# Altium schematic sheet AUDIO.SchDoc
size A3; SheetNumber: 6; SheetTotal: 6
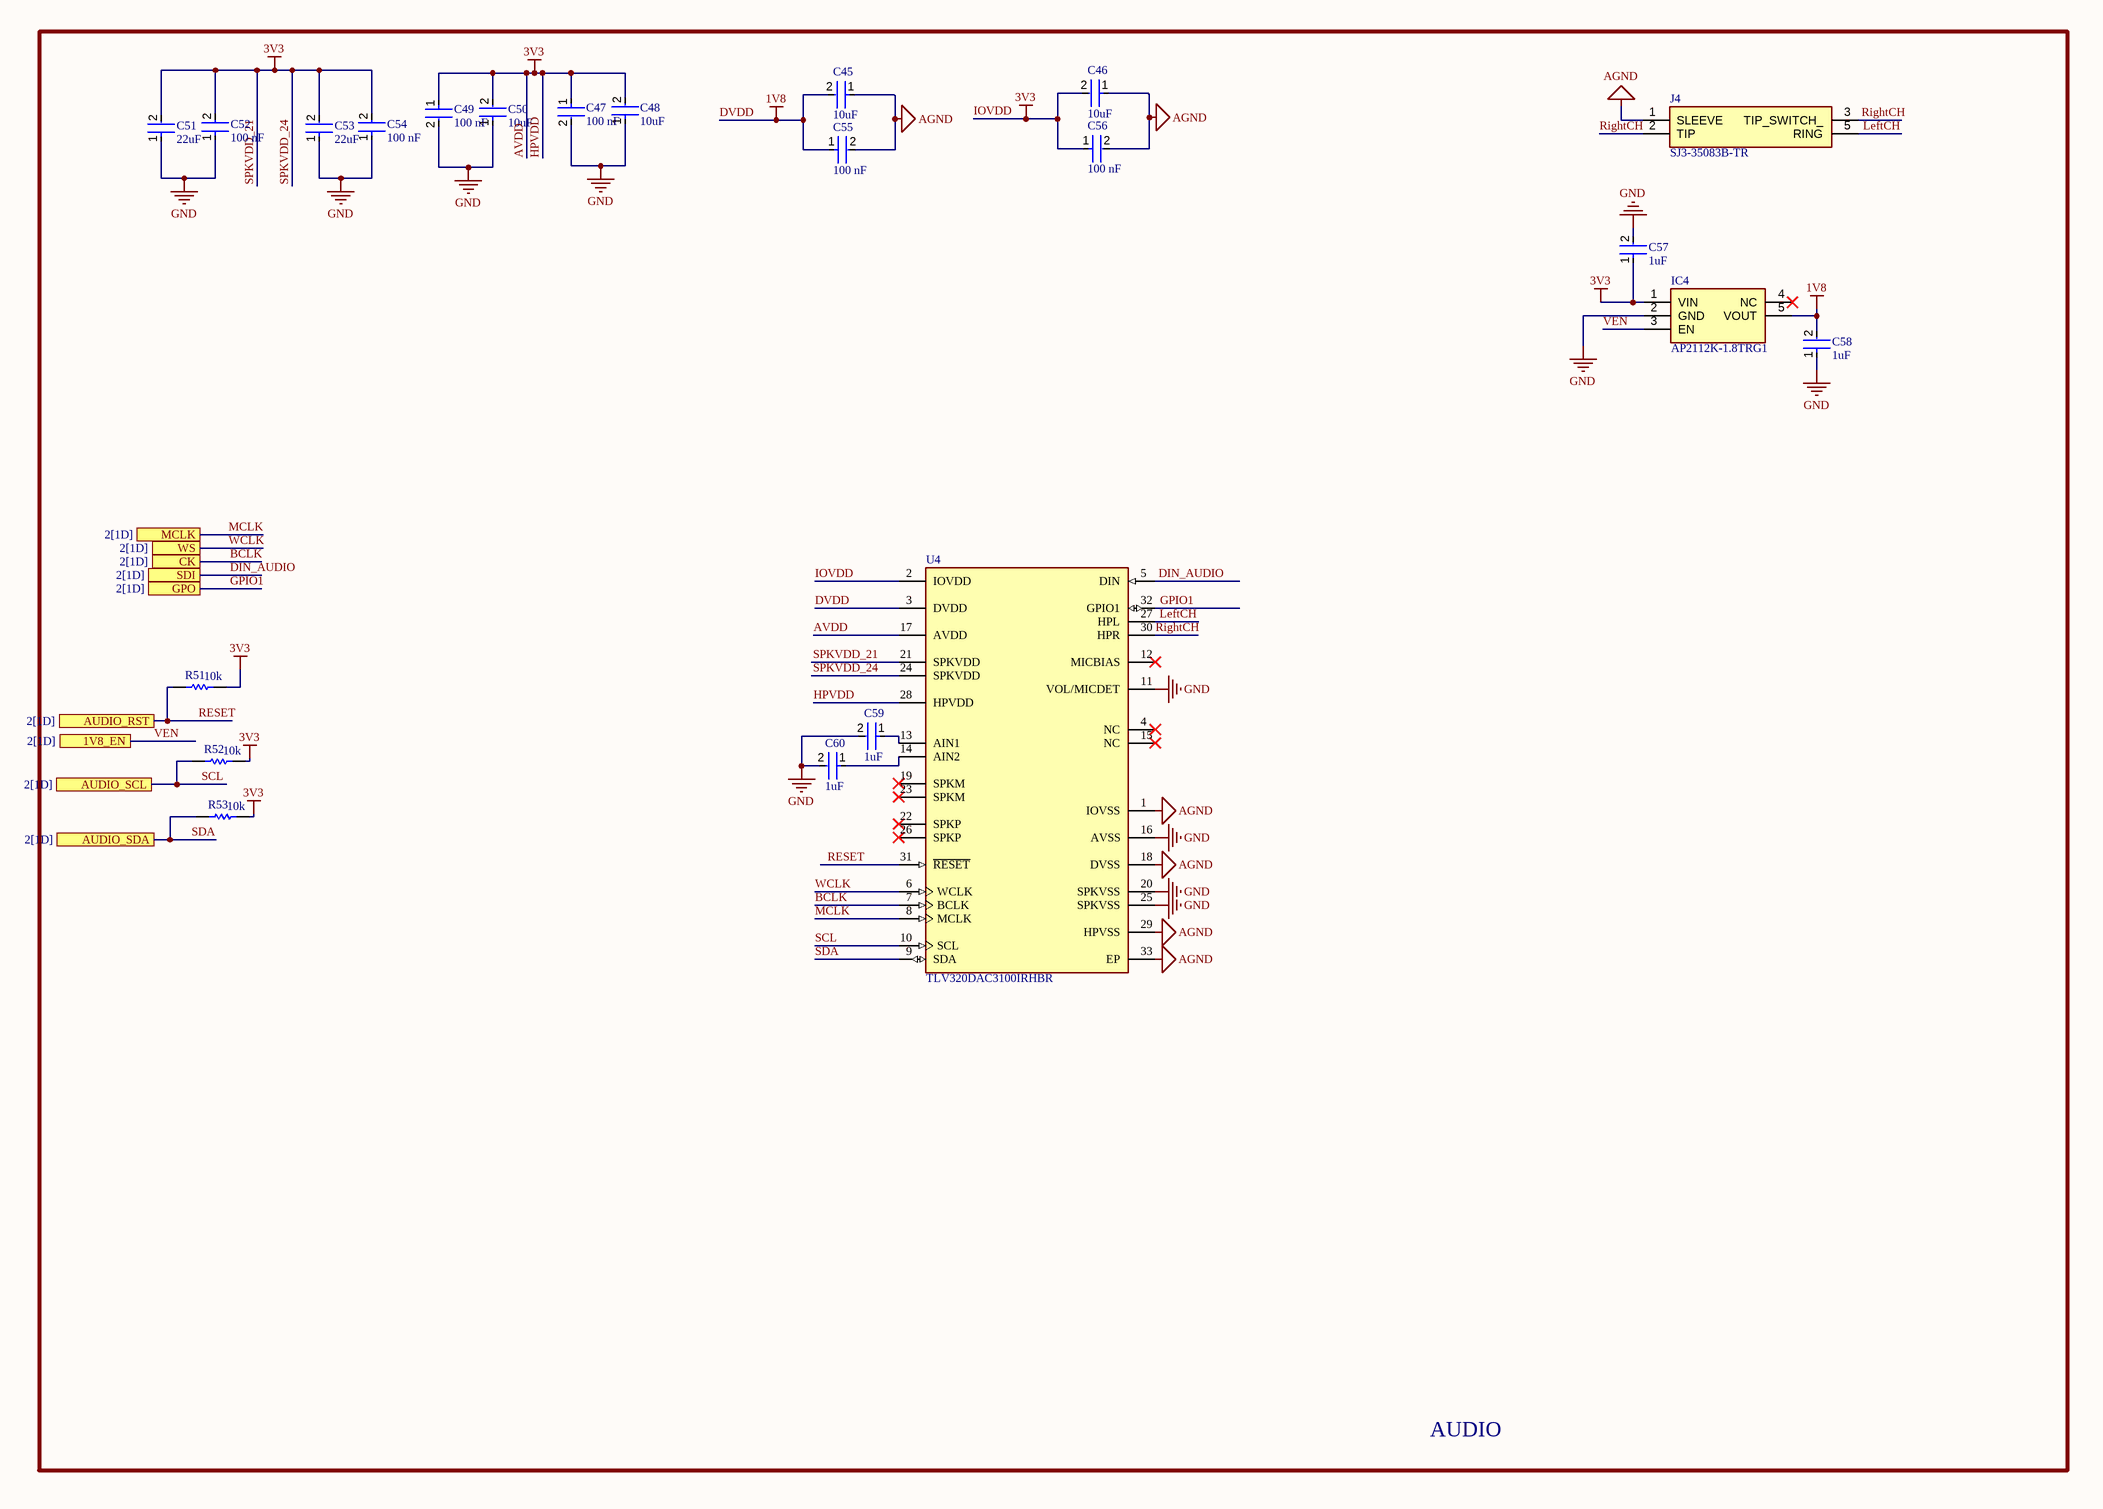
[diagram p0: AUDIO.SchDoc]

## Parts
C45  Capacitance: 10uF  [FP-GRM21B-0_15-IPC_A]  (hidden comment: GRM21BR61E106MA73L)
C46  Capacitance: 10uF  [FP-GRM21B-0_15-IPC_A]  (hidden comment: GRM21BR61E106MA73L)
C47  value 100 nF  [FP-CC0603-DA-MFG]  (hidden comment: CC0603KRX7R7BB104)
C48  Capacitance: 10uF  [FP-GRM21B-0_15-IPC_A]  (hidden comment: GRM21BR61E106MA73L)
C49  value 100 nF  [FP-CC0603-DA-MFG]  (hidden comment: CC0603KRX7R7BB104)
C50  Capacitance: 10uF  [FP-GRM21B-0_15-IPC_A]  (hidden comment: GRM21BR61E106MA73L)
C51  Capacitance: 22uF  [FP-1210-L_3_2_0_3-W_2_5_0-IPC_A]  (hidden comment: EMK325B7226MM-PR)
C52  value 100 nF  [FP-CC0603-DA-MFG]  (hidden comment: CC0603KRX7R7BB104)
C53  Capacitance: 22uF  [FP-1210-L_3_2_0_3-W_2_5_0-IPC_A]  (hidden comment: EMK325B7226MM-PR)
C54  value 100 nF  [FP-CC0603-DA-MFG]  (hidden comment: CC0603KRX7R7BB104)
C55  value 100 nF  [FP-CC0603-DA-MFG]  (hidden comment: CC0603KRX7R7BB104)
C56  value 100 nF  [FP-CC0603-DA-MFG]  (hidden comment: CC0603KRX7R7BB104)
C57  Capacitance: 1uF  [FP-CL21-IPC_B]  (hidden comment: CL21F105ZAFNNNF)
C58  Capacitance: 1uF  [FP-CL21-IPC_B]  (hidden comment: CL21F105ZAFNNNF)
C59  Capacitance: 1uF  [FP-CL21-IPC_B]  (hidden comment: CL21F105ZAFNNNF)
C60  Capacitance: 1uF  [FP-CL21-IPC_B]  (hidden comment: CL21F105ZAFNNNF)
IC4  AP2112K-1.8TRG1  [SOT95P285X140-5N]
J4  SJ3-35083B-TR  [SJ335083BTR]
R51  value 10k  [RESC1609X55X30NL10T20]  (hidden comment: TNPW060310K0BEEN)
R52  value 10k  [RESC1609X55X30NL10T20]  (hidden comment: TNPW060310K0BEEN)
R53  value 10k  [RESC1609X55X30NL10T20]  (hidden comment: TNPW060310K0BEEN)
U4  TLV320DAC3100IRHBR  [FP-RHB0032E-IPC_C]

## Ports
1V8_EN (see 2[1D]), AUDIO_RST (see 2[1D]), AUDIO_SCL (see 2[1D]), AUDIO_SDA (see 2[1D]), CK (see 2[1D]), GPO (see 2[1D]), MCLK (see 2[1D]), SDI (see 2[1D]), WS (see 2[1D])

## Nets
AGND: C45.1 C46.1 C55.2 C56.2 J4.1(SLEEVE) U4.1(IOVSS) U4.18(DVSS) U4.29(HPVSS) U4.33(EP)
AVDD: C46.2 C47.1 C48.2 C49.1 C50.2 C51.2 C52.2 C53.2 C54.2 C56.1 C57.1 IC4.1(VIN) R51.1 R52.1 R53.1 U4.2(IOVDD) U4.17(AVDD) U4.21(SPKVDD) U4.24(SPKVDD) U4.28(HPVDD)  [also labelled 3V3, HPVDD, IOVDD, SPKVDD_21, SPKVDD_24]
DVDD: C45.2 C55.1 C58.2 IC4.5(VOUT) U4.3(DVDD)  [also labelled 1V8]
GND: C47.2 C48.1 C49.2 C50.1 C51.1 C52.1 C53.1 C54.1 C57.2 C58.1 C59.2 C60.2 IC4.2(GND) U4.11(VOL/MICDET) U4.16(AVSS) U4.20(SPKVSS) U4.25(SPKVSS)
BCLK: U4.7(BCLK) ; port CK
DIN_AUDIO: U4.5(DIN) ; port SDI
GPIO1: U4.32(GPIO1) ; port GPO
LeftCH: J4.5(RING) U4.27(HPL)
MCLK: U4.8(MCLK) ; port MCLK
RESET: R51.2 U4.31(~{RESET}) ; port AUDIO_RST
RightCH: J4.2(TIP) J4.3(TIP_SWITCH_) U4.30(HPR)
SCL: R52.2 U4.10(SCL) ; port AUDIO_SCL
SDA: R53.2 U4.9(SDA) ; port AUDIO_SDA
VEN: IC4.3(EN) ; port 1V8_EN
WCLK: U4.6(WCLK) ; port WS
NetC59_1: C59.1 U4.13(AIN1)
NetC60_1: C60.1 U4.14(AIN2)

Not connected (* = marked no-connect by the designer): IC4 4(NC)*; U4 4(NC)* 12(MICBIAS)* 15(NC)* 19(SPKM)* 22(SPKP)* 23(SPKM)* 26(SPKP)*

## Notes on the sheet
- AUDIO
- THIS DOCUMENT AND THE DATA DISCLOSED HEREIN OR
- HEREWITH IS THE PROPERTY OF ALTIUM LIMITED AND MAY
- DWG NO:
- REVISION
- REV:
- DESCRIPTION
- DATE
- APPROVED
- BE FREELY DISTRIBUTED IN WHOLE. NO RIGHTS ARE
- RESERVED OR EXPRESS OR IMPLIED WARANTEE GIVEN.
- ENG:
- APPROVALS
- PROJECT
- DSN:
- CHK:
- REFERENCE DOCUMENTS
- PROJECT REVISION:
- TITLE
- DOCUMENT REVISION:
- DESIGN ITEM:
- BOM:
- FAB DWG:
- PCB DWG:
- ASSY DWG:
- SCALE:
- A3
- SIZE
- CAGE CODE
- FILE NAME
- DWG NO.
- SHEET
- OF
- REV

## Library data of the parts
C45 C46 C48 C50 = CMP-06035-013048-1: Chip Multilayer Ceramic Capacitors for General Purpose, 0805, 10uF, X5R, 15%, 20%, 25V; Max Operating Temperature: 85°C; Package Quantity: 3000; Case/Package: 0805; Depth: 1.25mm; Case Code (Imperial): 0805; Termination: SMD/SMT; Width: 0.049inch; Packaging: Tape and Reel; Tolerance: 20%; Height: 1.25mm; Min Operating Temperature: -55°C; Weight: 0.000335oz; Voltage Rating (DC): 25V; Dielectric: X5R; Length: 2mm; Thickness: 0.055inch; Voltage Rating: 25V; Resistor Type: Ceramic; Lead Free: Lead Free; Case Code (Metric): 2012; Mount: Surface Mount; REACH SVHC: No SVHC
C47 C49 C52 C54-C56 = CMP-2000-05002-2: CAP CER 0.1UF 16V X7R 0603; Manufacturer: YAGEO; Tolerance: 0.1; Temperature Coefficient: 15%; Material: Ceramic; Voltage Rating: 16 V; Package: CC0603-DA; ComponentLink2Description: Datasheet; Octopart: https://octopart.com/cc0603krx7r7bb104-yageo-192941; Temperature Range High: +125°C; Digikey Description: CAP CER 0.1UF 16V X7R 0603; Voltage: 16 V; Device Class L2: Capacitors; Height: 0.9mm; Temperature: -55°C to +125°C; Manufacturer Part Number: CC0603KRX7R7BB104; Device Class L1: Passive Components; Device Class L3: Ceramic Capacitors; ComponentLink2URL: http://www.yageo.com/documents/recent/UPY-GPHC_X7R_6.3V-to-50V_18.pdf; Footprint Url: http://www.yageo.com/exep/pages/download/literatures/UPY-C_GEN_24.pdf; RoHS: TRUE; Temperature Range Low: -55°C; Temperature Characteristic: X7R; Lead Free: Yes; Capacitance: 100 nF; Category: Cap; Mouser Description: Multilayer Ceramic Capacitor, CC Series, 0.1 - F, - 10%, X7R, 16 V, 0603 [1608 Metric]; Automotive: No
C51 C53 = CMP-14477-001108-2: None; Tolerance: 20%; Voltage Rating: 16V; Case Code (Imperial): 1210; Max Operating Temperature: 125°C; RoHS Compliant: Yes; Min Operating Temperature: -55°C; Mount: Surface Mount; Case/Package: 1210; Packaging: Tape and Reel; Case Code (Metric): 3225
C57-C60 = CMP-13271-002018-1: CL21 Series 0805 1uF 25V -20/+80% Tolerance Y5V Multilayer Ceramic Chip Capacitor; Tolerance: 80%; Voltage Rating: 25V; Voltage Rating (DC): 25V; Thickness: 0.053inch; Radiation Hardening: No; Width: 0.049inch; Height: 1.25mm; Max Operating Temperature: 85°C; Mount: Surface Mount; Package Quantity: 10000; Depth: 1.25mm; Min Operating Temperature: -30°C; Packaging: Tape and Reel; Case/Package: 0805; Length: 2mm; Dielectric: Y5V
IC4 = AP2112K-1.8TRG1: Integrated Circuit; Manufacturer_Name: Diodes Incorporated; Datasheet Link: https://www.diodes.com//assets/Datasheets/AP2112.pdf; Height: 1.4mm; Manufacturer_Part_Number: AP2112K-1.8TRG1; Mouser Part Number: 621-AP2112K-1.8TRG1; Mouser Price/Stock: https://www.mouser.co.uk/ProductDetail/Diodes-Incorporated/AP2112K-1.8TRG1?qs=x6A8l6qLYDBx1xhw8AX2cw%3D%3D; Arrow Part Number: AP2112K-1.8TRG1; Arrow Price/Stock: https://www.arrow.com/en/products/ap2112k-1.8trg1/diodes-incorporated?utm_currency=USD&region=nac
J4 = SJ3-35083B-TR: Connector; Manufacturer_Name: Same Sky; Datasheet Link: https://www.sameskydevices.com/product/resource/supplyframepdf/sj3-3508x.pdf; Height: 5.3mm; Manufacturer_Part_Number: SJ3-35083B-TR; Mouser Part Number: 179-SJ3-35083B-TR; Mouser Price/Stock: https://www.mouser.co.uk/ProductDetail/Same-Sky/SJ3-35083B-TR?qs=IKkN%2F947nfDjNSxAQdYIVA%3D%3D
R51-R53 = CMP-2000-03692-1: Manufacturer: Vishay Dale; Part Number: TNPW060310K0BEEN
U4 = CMP-04894-000031-1: IC DAC 24BIT 192K 32VQFN; Sampling Rate: 192000S/s; Number of Analog Outputs: 4; Supply Type: Analog; Power Consumption: 13mW; Number of DAC Channels: 2; Resolution: 24b; Interface: I2C; Lead Free: Lead Free; Min Operating Temperature: -40°C; Series: TLV320DAC3100; Mount: Surface Mount; Max Operating Temperature: 85°C; RoHS Compliant: Yes; Radiation Hardening: No; Package Quantity: 3000; Packaging: Tape and Reel; Case/Package: VQFN; Number of Analog Inputs: 2